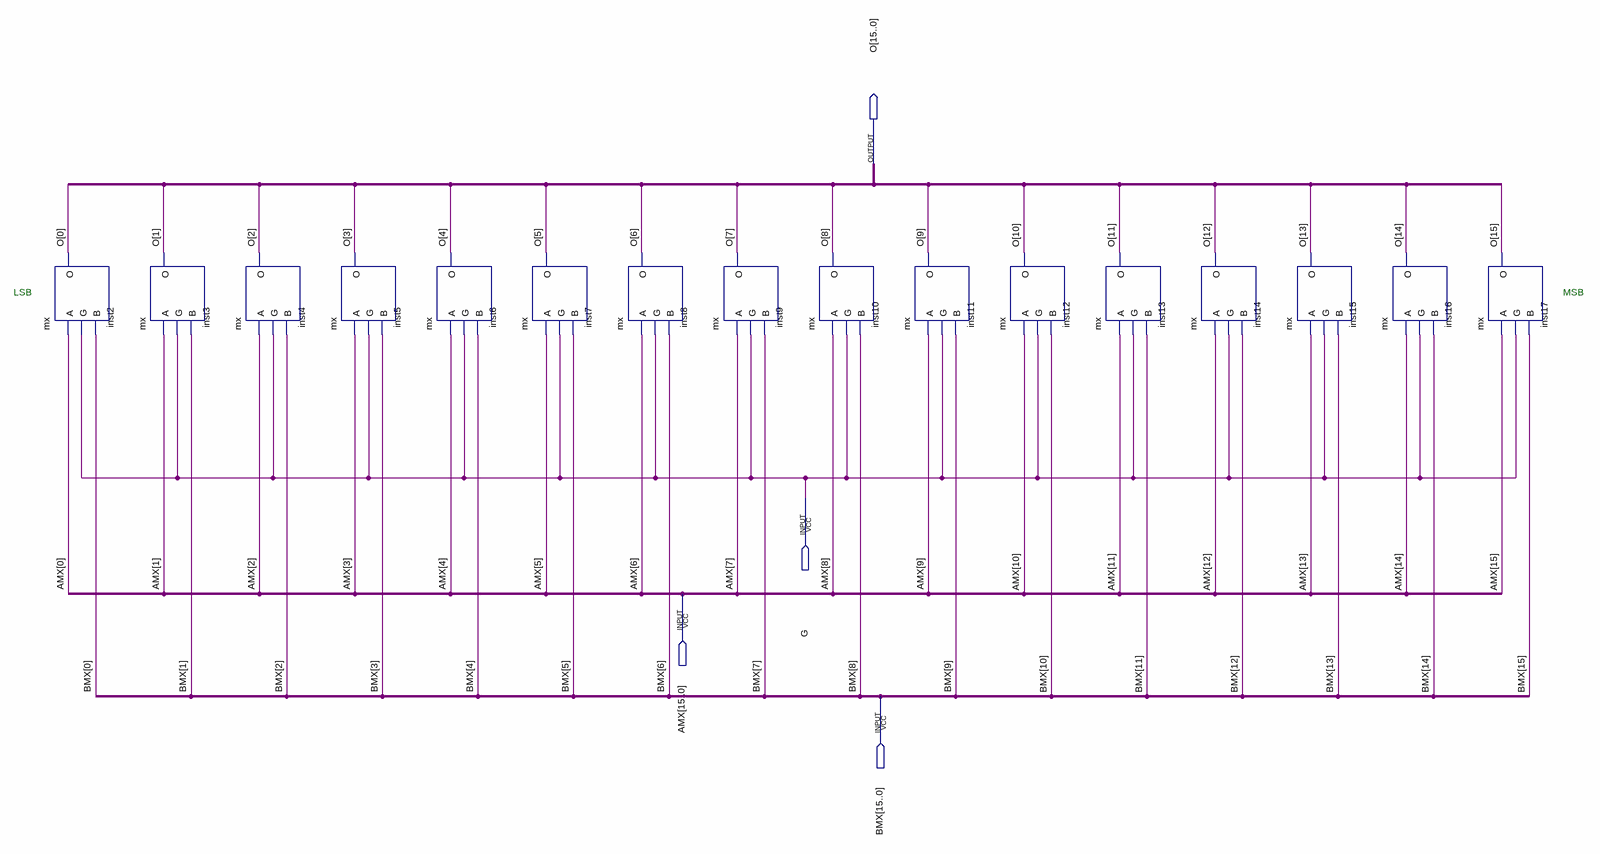
[diagram p0: schematic sheet]
// Quartus schematic 16bitmux.bdf as structural Verilog: 16 symbols, 4 pins
module \16bitmux  (
  input  G,
  input  [15:0] AMX,
  input  [15:0] BMX,
  output [15:0] O
);

  mx inst2 (.A(AMX[0]), .G(G), .B(BMX[0]), .O(O[0]));
  mx inst3 (.A(AMX[1]), .G(G), .B(BMX[1]), .O(O[1]));
  mx inst4 (.A(AMX[2]), .G(G), .B(BMX[2]), .O(O[2]));
  mx inst5 (.A(AMX[3]), .G(G), .B(BMX[3]), .O(O[3]));
  mx inst6 (.A(AMX[4]), .G(G), .B(BMX[4]), .O(O[4]));
  mx inst7 (.A(AMX[5]), .G(G), .B(BMX[5]), .O(O[5]));
  mx inst8 (.A(AMX[6]), .G(G), .B(BMX[6]), .O(O[6]));
  mx inst9 (.A(AMX[7]), .G(G), .B(BMX[7]), .O(O[7]));
  mx inst10 (.A(AMX[8]), .G(G), .B(BMX[8]), .O(O[8]));
  mx inst11 (.A(AMX[9]), .G(G), .B(BMX[9]), .O(O[9]));
  mx inst12 (.A(AMX[10]), .G(G), .B(BMX[10]), .O(O[10]));
  mx inst13 (.A(AMX[11]), .G(G), .B(BMX[11]), .O(O[11]));
  mx inst14 (.A(AMX[12]), .G(G), .B(BMX[12]), .O(O[12]));
  mx inst15 (.A(AMX[13]), .G(G), .B(BMX[13]), .O(O[13]));
  mx inst16 (.A(AMX[14]), .G(G), .B(BMX[14]), .O(O[14]));
  mx inst17 (.A(AMX[15]), .G(G), .B(BMX[15]), .O(O[15]));

  // Notes on the sheet:
  //   LSB
  //   MSB
endmodule
